# Altium schematic sheet PlusBit_ExtraMemory.SchDoc
size A3; SheetNumber: 4; SheetTotal: 5
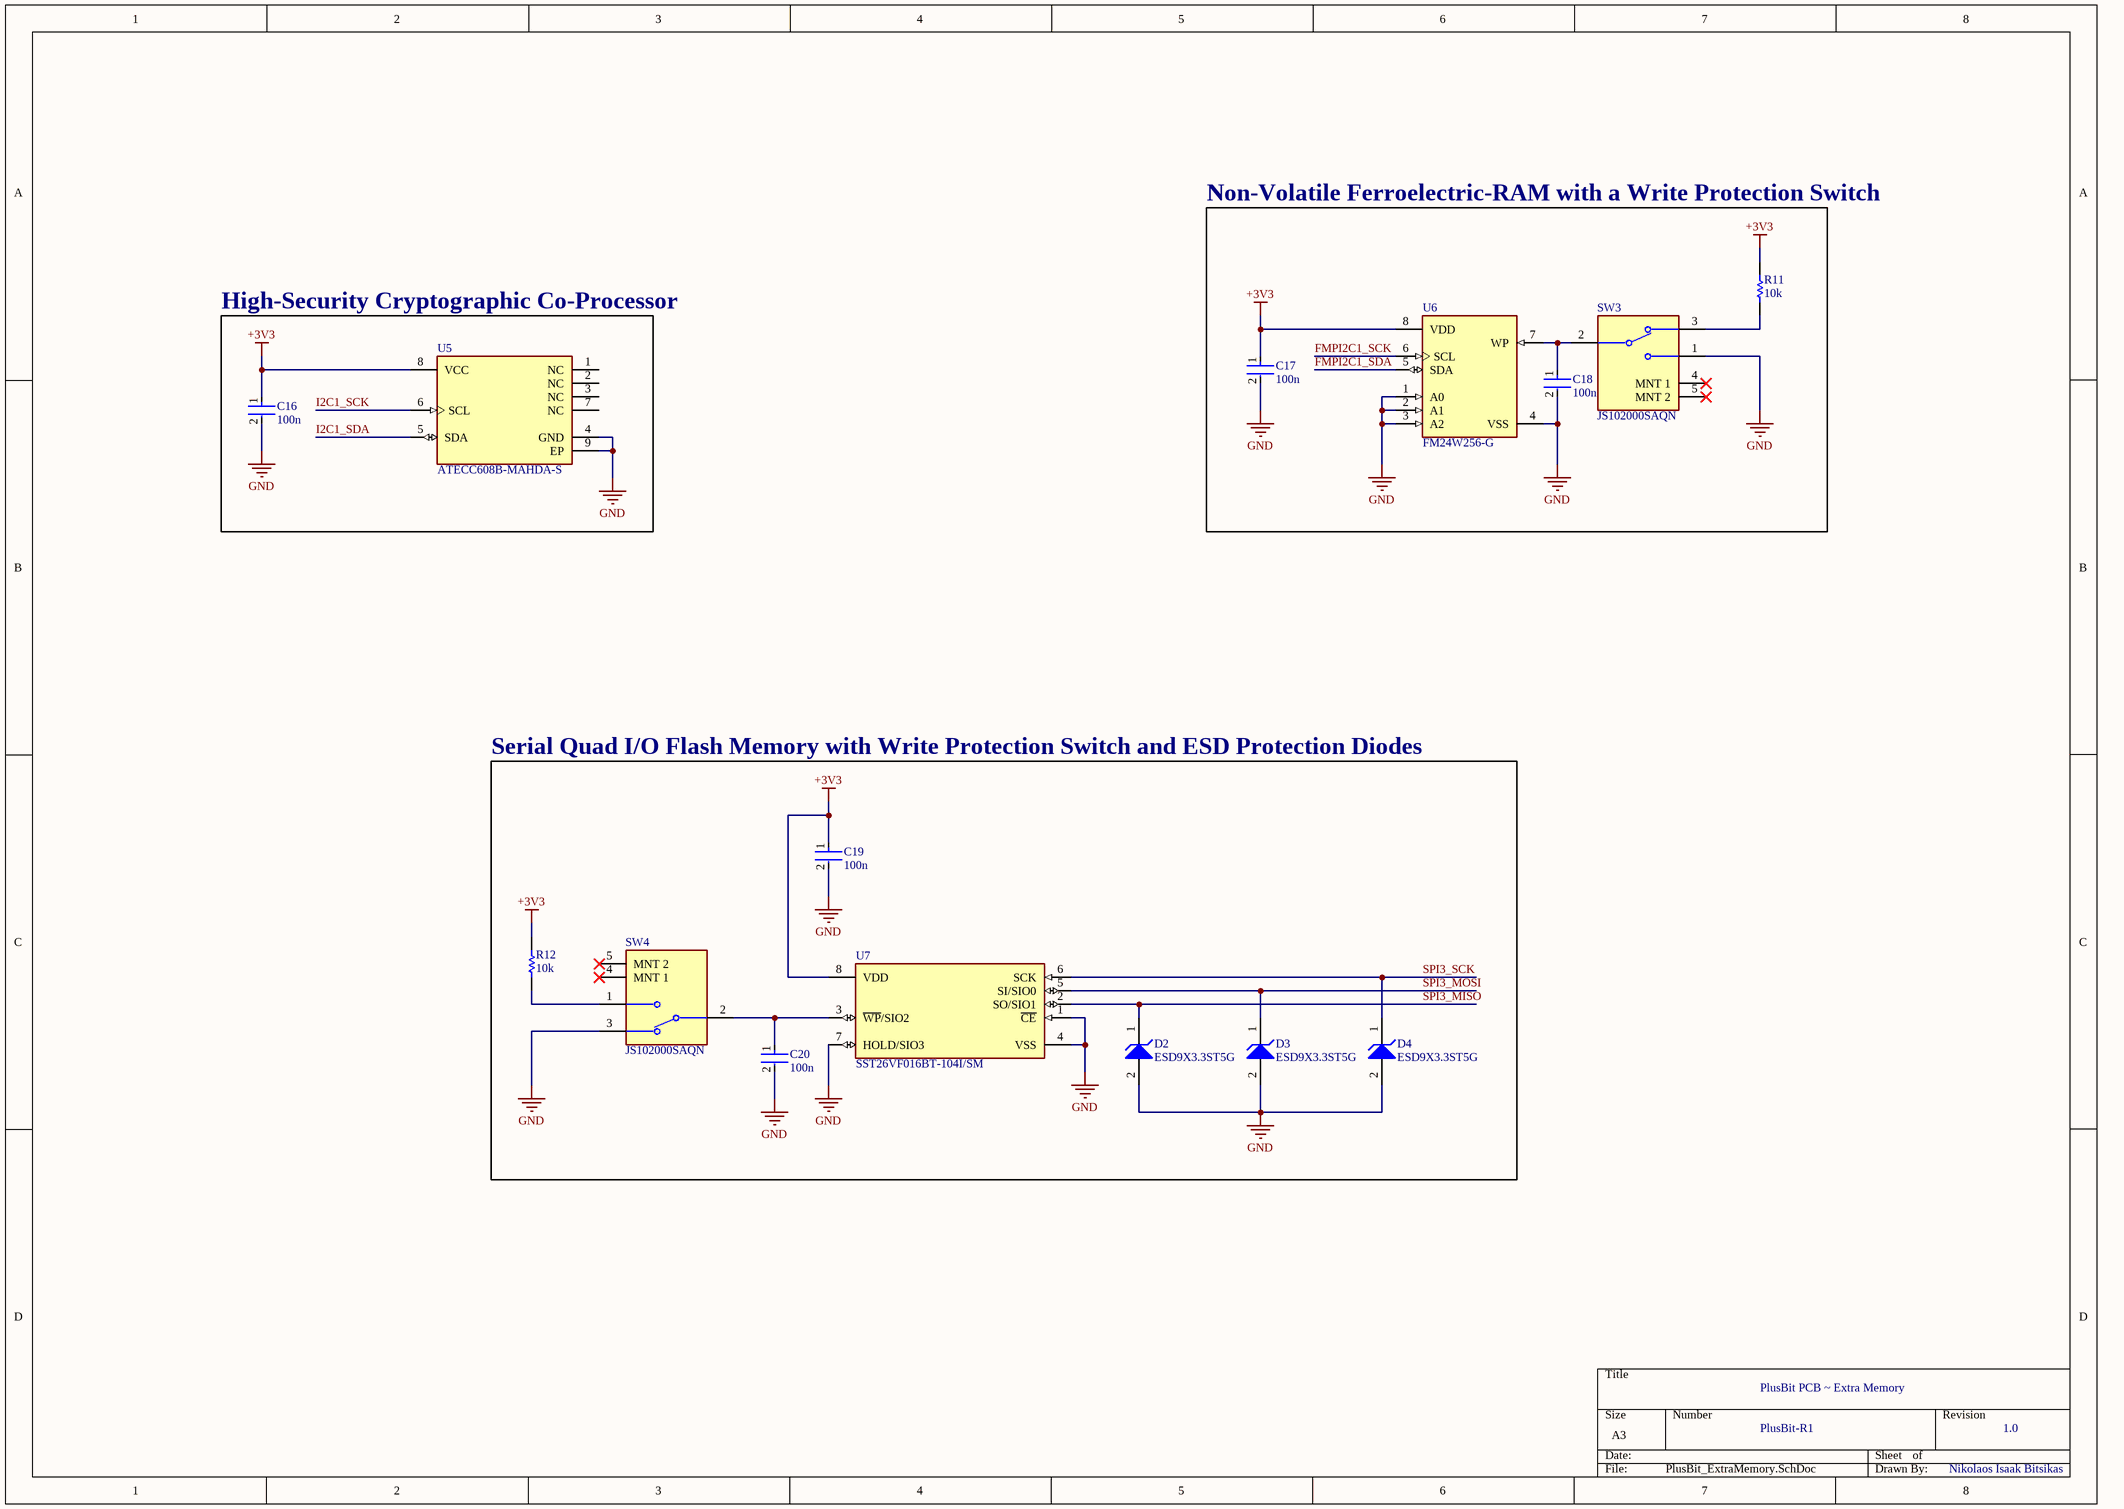
[diagram p0: PlusBit_ExtraMemory.SchDoc]

## Parts
C16  100n  [FP-C0402-BB-MFG]
C17  100n  [FP-C0402-BB-MFG]
C18  100n  [FP-C0402-BB-MFG]
C19  100n  [FP-C0402-BB-MFG]
C20  100n  [FP-C0402-BB-MFG]
D2  ESD9X3.3ST5G  [ONSC-SOD-923-2-514AA-01_V]
D3  ESD9X3.3ST5G  [ONSC-SOD-923-2-514AA-01_V]
D4  ESD9X3.3ST5G  [ONSC-SOD-923-2-514AA-01_V]
R11  10k  [RESC1608X55X25ML10T15]
R12  10k  [RESC1608X55X25ML10T15]
SW3  JS102000SAQN  [FP-JS102000SAQN-MFG]
SW4  JS102000SAQN  [FP-JS102000SAQN-MFG]
U5  ATECC608B-MAHDA-S  [FP-C04-21355-Q4B-IPC_B]
U6  FM24W256-G  [FP-51-85066-MFG]
U7  SST26VF016BT-104I/SM  [FP-C04-056-MFG]

## Blocks framed on the sheet
High-Security Cryptographic Co-Processor: C16 U5

## Nets
+3V3: C16.1 C17.1 C19.1 R11.2 R12.2 U5.8(VCC) U6.8(VDD) U7.8(VDD)
GND: C16.2 C17.2 C18.2 C19.2 C20.2 D2.2(A) D3.2(A) D4.2(A) SW3.1 SW4.3 U5.4(GND) U5.9(EP) U6.1(A0) U6.2(A1) U6.3(A2) U6.4(VSS) U7.1(~{CE}) U7.4(VSS) U7.7(HOLD/SIO3)
FMPI2C1_SCK: U6.6(SCL)
FMPI2C1_SDA: U6.5(SDA)
I2C1_SCK: U5.6(SCL)
I2C1_SDA: U5.5(SDA)
SPI3_MISO: D2.1(K) U7.2(SO/SIO1)
SPI3_MOSI: D3.1(K) U7.5(SI/SIO0)
SPI3_SCK: D4.1(K) U7.6(SCK)
NetC18_1: C18.1 SW3.2(C) U6.7(WP)
NetC20_1: C20.1 SW4.2(C) U7.3(~{WP}/SIO2)
NetR11_1: R11.1 SW3.3
NetR12_1: R12.1 SW4.1

Not connected (* = marked no-connect by the designer): SW3 4(MNT_1)* 5(MNT_2)*; SW4 4(MNT_1)* 5(MNT_2)*; U5 1(NC) 2(NC) 3(NC) 7(NC)

## Notes on the sheet
- Non-Volatile Ferroelectric-RAM with a Write Protection Switch
- Serial Quad I/O Flash Memory with Write Protection Switch and ESD Protection Diodes
- PlusBit PCB ~ Extra Memory
- PlusBit-R1
- 1.0
- Nikolaos Isaak Bitsikas

## Library data of the parts
C16-C20 = CMP-2008-02046-2: CAP CER 0.1UF 10V X5R 0402; Manufacturer: Kemet; Manufacturer Part Number: C0402C104K8PACTU; Material: Ceramic; Capacitance: 0.10 μF; Temperature Coefficient: 15%; Tolerance: 0.1; Value: 0.10 μF; Package: C0402-BB; Temperature: -55°C to +125°C; ComponentLink2Description: Datasheet; Temperature Characteristic: X5R; Device Class L1: Passive Components; Height: 0.55mm; Lead Free: Yes; ComponentLink2URL: https://content.kemet.com/datasheets/KEM_C1002_X7R_SMD.pdf; Device Class L2: Capacitors; Temperature Range Low: -55°C; Temperature Range High: +125°C; RoHS: TRUE; Octopart: https://octopart.com/c0402c104k8pactu-kemet-140039; Automotive: No; Mouser Description: Capacitor 100 nF 10 VDC 0402; Category: Cap; Voltage Rating: 10 V; Digikey Description: CAP CER 0.1UF 10V X5R 0402; Ipc Land Pattern Name: CAPC10050X50; Device Class L3: Ceramic Capacitors
D2-D4 = CMP-1063-00106-1: Transient Voltage Suppressor, Micro-Packaged Diode for ESD Protection, 2-Pin SOD-923, Pb-Free, Tape and Reel; Manufacturer: On Semiconductor; V(BR) Min (V): 5; Direction: Unidirectional; VRWM Max (V): 3.3; Number of Lines: 1; IR Max (uA): 2.5; ComponentLink3URL: http://www.onsemi.com/pub_link/Collateral/514AA.PDF; ComponentLink1URL: http://www.onsemi.com/; ComponentLink2Description: Datasheet; ComponentLink2URL: http://www.onsemi.cn/pub_link/Collateral/ESD9X3.3ST5G-D.PDF; PackageVersion: Rev. E, 03/2011; PackageReference: SOD-923-2-514AA-01; PartNumber: ESD9X3.3ST5G; Mounting Technology: Surface Mount; RoHS: Pb-Free; ComponentLink1Description: Manufacturer URL; Packing: Tape and Reel; ComponentLink3Description: Package Specification; DatasheetVersion: Rev. 7; PackageDescription: 2-Pin SOD, Body 0.8 x 0.6 mm
R11 R12 = CMP-2000-05022-1: Resistor, 10 KOhm, +/- 5%, 100 mW, -55 to 155 degC, 0603 (1608 Metric), RoHS, Tape and Reel; Manufacturer: Yageo; Resistance: 10kOhms; Voltage Rating: 50V; Temperature Coefficient: 100PPM/C; Power Rating: 100mW; Package Reference: 603; Series: RC; Case Code - mm: 1608; Packaging: Reel; Datasheet URL: http://www.farnell.com/datasheets/443971.pdf; Datasheet Version: Rev. 4, 04/2009; Operating Temperature Range: -55Cto+155C; Product: ThickFilmResistorsGeneralPurpose; Package Description: 2-Pin Surface Mount Device, Body 1.6 x 0.8 mm; Manufacturer URL: http://www.yageo.com/; Case Code - in: 0603; Tolerance: 5%; Termination Style: SMD/SMT
SW3 SW4 = CMP-10038-000025-1: SWITCH SLIDE SPDT 1MA 5V; Actuator Material: Nylon; Contact Resistance: 70mR; Electrical Life: 15000Cycles; Actuator Length: 1.5mm; Switch Function: On-On; Actuator Type: Standard; Actuator Color: Black; Current Rating: 1mA; Throw Configuration: SPDT; Termination: Gull Wing; Housing Material: Nylon; Max Operating Temperature: 85°C; Max Voltage Rating (DC): 5V; Voltage Rating (DC): 5V; Contact Plating: Silver; Radiation Hardening: No; Package Quantity: 1; REACH SVHC: No SVHC; RoHS Compliant: Yes; Orientation: Right Angle; Max Current Rating: 1mA; Case/Package: SMD/SMT; Contact Current Rating: 1mA; Contact Material: Copper Alloy; Mount: Surface Mount; Flammability Rating: UL94 V-2; Packaging: Tape and Reel; Switch Travel: 1.5mm; Length: 7.8mm; Series: JS; Min Operating Temperature: -20°C; Depth: 4.82mm
U5 = CMP-06260-000008-1: IC AUTHENTICATION CHIP
U6 = CMP-12945-000008-1: IC FRAM 256K I2C 1MHZ 8SOIC; Manufacturer: Cypress Semiconductor; Standoff Height: 0.1mm; Memory Size: 256Kbits; Min Supply Voltage: 2.7V; Interface: I2C,2-Wire; Max Supply Voltage: 5.5V; Memory Type: OTHER; Access Time: 0.55us; Nominal Supply Current: 100-400uA; Temperature: -40°C to +85°C; Digikey Description: IC FRAM 256K I2C 1MHZ 8SOIC; Device Class L2: Memory; ComponentLink2Description: Datasheet; Manufacturer Part Number: FM24W256-G; Ambient Temperature Range High: +85°C; Device Class L1: Integrated Circuits (ICs); Temperature Range High: +85°C; Footprint Url: https://www.cypress.com/file/42881/download; Frequency: 1MHz; Octopart: https://octopart.com/fm24w256-g-cypress+semiconductor-25377035; Ambient Temperature Range Low: -40°C; Temperature Range Low: -40°C; Category: IC; Mouser Description: F-RAM IIC FRAM 256k 3-5V F-RAM; Automotive: No; ComponentLink2URL: https://www.cypress.com/file/136451/download; Lead Free: Yes; Ipc Land Pattern Name: SOIC127P602X164-8; Package: 51-85066; RoHS: TRUE; Device Class L3: unset; Height: 1.727mm
U7 = CMP-00252-49237277-1: SST26VF016BT-104I/SM Flash Memory, SQI Flash Memory, 16Mb 1.8V; Access Time: 8ns; Interface: SPI; Memory Size: 2MB; Page Size: 256B; Frequency: 104MHz; Max Supply Voltage: 3.6V; Min Supply Voltage: 2.7V; Memory Type: FLASH; Height: 2.03mm; Density: 16Mb; Schedule B: 8542320050, 8542320050; Lifecycle Status: Production; Mount: Surface Mount; Packaging: Tape & Reel (TR); Number of Pins: 8; RoHS: Compliant; Max Operating Temperature: 85°C; Min Operating Temperature: -40°C; Case/Package: SOIC; NexarPartId: 49237277; Contact Plating: Tin